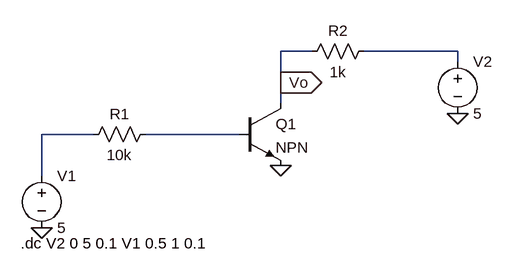
[diagram p0: schematic npn_IV.asc]
npn_IV.asc, the LTspice schematic file:
Version 4
SHEET 1 880 680
WIRE 448 -16 400 -16
WIRE 672 -16 528 -16
WIRE 672 0 672 -16
WIRE 400 32 400 -16
WIRE 400 64 400 32
WIRE 112 112 32 112
WIRE 336 112 192 112
WIRE 32 176 32 112
FLAG 32 256 0
FLAG 400 160 0
FLAG 672 80 0
FLAG 400 32 Vo
IOPIN 400 32 Out
SYMBOL voltage 32 160 R0
SYMATTR InstName V1
SYMATTR Value 5
SYMBOL voltage 672 -16 R0
SYMATTR InstName V2
SYMATTR Value 5
SYMBOL res 208 96 R90
WINDOW 0 0 56 VBottom 2
WINDOW 3 32 56 VTop 2
SYMATTR InstName R1
SYMATTR Value 10k
SYMBOL res 432 0 R270
WINDOW 0 32 56 VTop 2
WINDOW 3 0 56 VBottom 2
SYMATTR InstName R2
SYMATTR Value 1k
SYMBOL npn 336 64 R0
SYMATTR InstName Q1
TEXT 0 280 Left 2 !.dc V2 0 5 0.1 V1 0.5 1 0.1

The netlist it stands for:
* npn_IV.asc
V1 N002 0 5
V2 N001 0 5
R1 N003 N002 10k
R2 Vo N001 1k
Q1 Vo N003 0 0 NPN
.model NPN NPN
.model PNP PNP
.lib standard.bjt
.dc V2 0 5 0.1 V1 0.5 1 0.1
.backanno
.end